# EAGLE schematic DyIO_Rev14 (EAGLE 5.11)

## Sheet 1 of 6
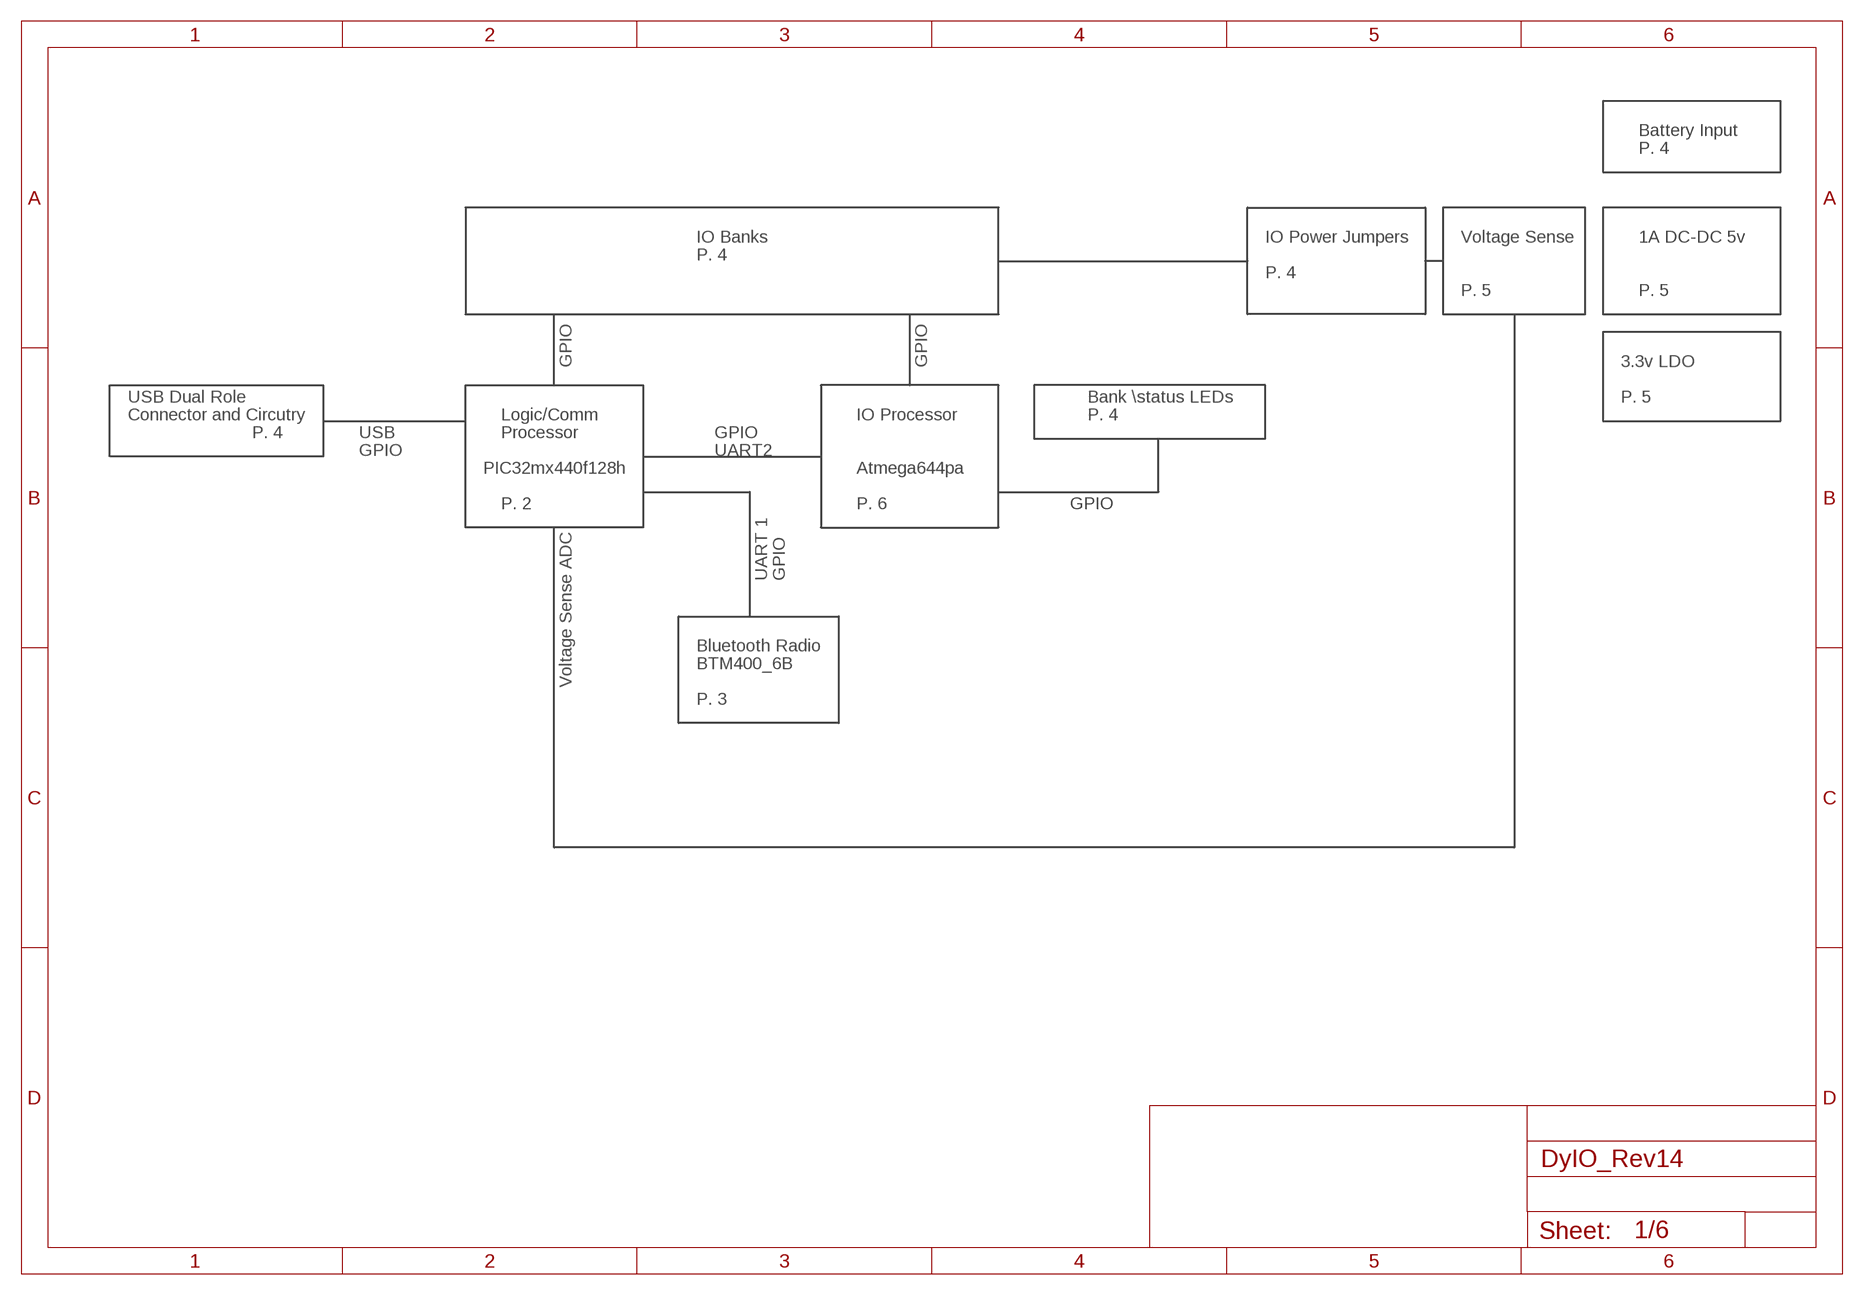
[diagram p0: schematic, sheet 1]

### Notes on the sheet
- Battery Input
- P. 4
- IO Banks | IO Power Jumpers | Voltage Sense | 1A DC-DC 5v
- P. 4
- P. 4
- P. 5 | P. 5
- GPIO | GPIO | 3.3v LDO
- USB Dual Role | Bank \status LEDs | P. 5
- Connector and Circutry | Logic/Comm | IO Processor | P. 4
- P. 4 | USB | Processor | GPIO
- GPIO | UART2
- PIC32mx440f128h | Atmega644pa
- P. 2 | P. 6 | GPIO
- UART 1 | GPIO
- Bluetooth Radio
- BTM400_6B
- Voltage Sense ADC
- P. 3

## Sheet 2 of 6
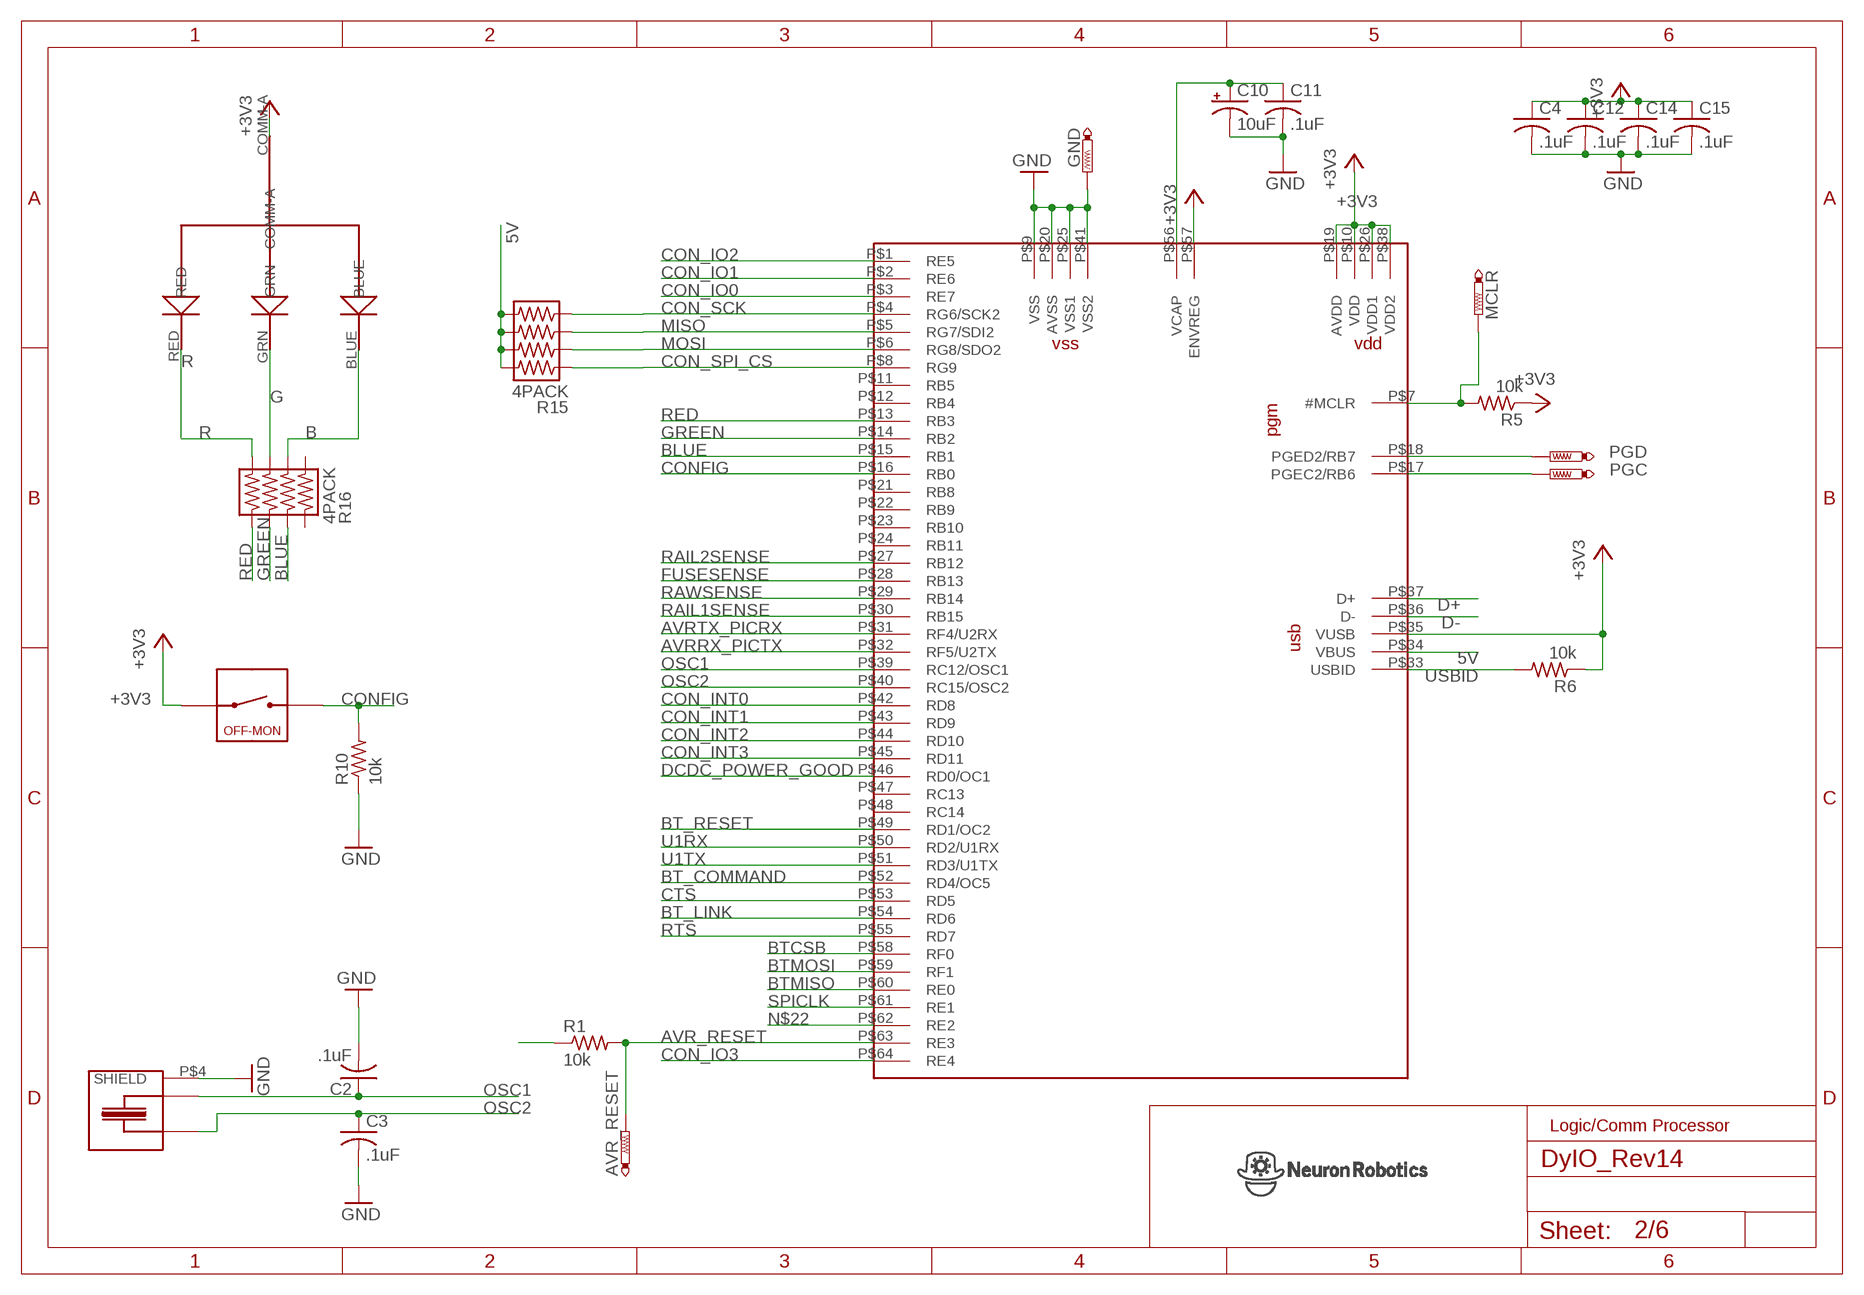
[diagram p1: schematic, sheet 2]

### Parts
AVR_RESET  PTR1TP14R  [TP14R]
C2  .1uF  C-USC0603  [C0603]
C3  .1uF  C-USC0603  [C0603]
C4  .1uF  C-USC0603  [C0603]
C10  10uF  CPOL-USR/2012-12R  [R/2012-12R]
C11  .1uF  C-USC0603  [C0603]
C12  .1uF  C-USC0603  [C0603]
C14  .1uF  C-USC0603  [C0603]
C15  .1uF  C-USC0603  [C0603]
GND  PTR1B1,27  [B1,27]
MCLR  PTR1TP14R  [TP14R]
PGC  PTR1TP14R  [TP14R]
PGD  PTR1TP14R  [TP14R]
R1  10k  R-US_R0603  [R0603]
R5  10k  R-US_R0603  [R0603]
R6  10k  R-US_R0603  [R0603]
R10  10k  R-US_R0603  [R0603]
R15  4PACK  [4PACK_0603]
R16  4PACK  [4PACK_0603]
SW3  SPST  [B3U-1000P]
U3  PIC32-64TQFP64-2  [TQFP64-2]
U8  TRI-LED-SMD  [TRI_LED_SMD]
X2  CMR3XXT  [CMR309T]

### Nets
5V: R1.1 R15.R1A R15.R2A R15.R3A R15.R4A U3.P$34(VBUS) ; also sheet 4,5,6
32MCLR: MCLR.TP R5.2 U3.P$7(#MCLR)
32PGC: PGC.TP U3.P$17(PGEC2/RB6)
32PGD: PGD.TP U3.P$18(PGED2/RB7)
+3V3: C4.1 C12.1 C14.1 C15.1 R5.1 R6.1 SW3.P$1 U3.P$10(VDD) U3.P$19(AVDD) U3.P$26(VDD1) U3.P$35(VUSB) U3.P$38(VDD2) U3.P$57(ENVREG) U8.COMM-A ; also sheet 3,5
AVR_RESET: AVR_RESET.TP R1.2 U3.P$63(RE3) ; also sheet 6
AVRRX_PICTX: U3.P$32(RF5/U2TX) ; also sheet 6
AVRTX_PICRX: U3.P$31(RF4/U2RX) ; also sheet 6
B: R16.R2A U8.BLUE
BLUE: R16.R2B U3.P$15(RB1)
BT_COMMAND: U3.P$52(RD4/OC5) ; also sheet 3
BT_LINK: U3.P$54(RD6) ; also sheet 3
BT_RESET: U3.P$49(RD1/OC2) ; also sheet 3
BTCSB: U3.P$58(RF0) ; also sheet 3
BTMISO: U3.P$60(RE0) ; also sheet 3
BTMOSI: U3.P$59(RF1) ; also sheet 3
CON_INT0: U3.P$42(RD8) ; also sheet 4,6
CON_INT1: U3.P$43(RD9) ; also sheet 4,6
CON_INT2: U3.P$44(RD10) ; also sheet 4,6
CON_INT3: U3.P$45(RD11) ; also sheet 4,6
CON_IO0: U3.P$3(RE7) ; also sheet 4,6
CON_IO1: U3.P$2(RE6) ; also sheet 4,6
CON_IO2: U3.P$1(RE5) ; also sheet 4,6
CON_IO3: U3.P$64(RE4) ; also sheet 4,6
CON_SCK: R15.R4B U3.P$4(RG6/SCK2) ; also sheet 4,6
CON_SPI_CS: R15.R1B U3.P$8(RG9) ; also sheet 4,6
CONFIG: R10.2 SW3.P$3 U3.P$16(RB0)
CTS: U3.P$53(RD5) ; also sheet 6
D+: U3.P$37(D+) ; also sheet 4
D-: U3.P$36(D-) ; also sheet 4
DCDC_POWER_GOOD: U3.P$46(RD0/OC1) ; also sheet 5
FUSESENSE: U3.P$28(RB13) ; also sheet 5
G: R16.R3A U8.GRN
GND: C2.2 C3.2 C4.2 C10.- C11.2 C12.2 C14.2 C15.2 GND.PP(TP) R10.1 U3.P$9(VSS) U3.P$20(AVSS) U3.P$25(VSS1) U3.P$41(VSS2) X2.P$4(SHIELD) ; also sheet 3,4,5,6
GREEN: R16.R3B U3.P$14(RB2)
MISO: R15.R3B U3.P$5(RG7/SDI2) ; also sheet 4,6
MOSI: R15.R2B U3.P$6(RG8/SDO2) ; also sheet 4,6
N$5: C10.+ C11.1 U3.P$56(VCAP)
N$22: U3.P$62(RE2)
OSC1: C2.1 U3.P$39(RC12/OSC1) X2.P$3
OSC2: C3.1 U3.P$40(RC15/OSC2) X2.P$1
R: R16.R4A U8.RED
RAIL1SENSE: U3.P$30(RB15) ; also sheet 5
RAIL2SENSE: U3.P$27(RB12) ; also sheet 5
RAWSENSE: U3.P$29(RB14) ; also sheet 5
RED: R16.R4B U3.P$13(RB3)
RTS: U3.P$55(RD7) ; also sheet 6
SPICLK: U3.P$61(RE1) ; also sheet 3
U1RX: U3.P$50(RD2/U1RX) ; also sheet 3
U1TX: U3.P$51(RD3/U1TX) ; also sheet 3
USBID: R6.2 U3.P$33(USBID) ; also sheet 4
Unconnected: R16.R1A R16.R1B U3.P$11(RB5) U3.P$12(RB4) U3.P$21(RB8) U3.P$22(RB9) U3.P$23(RB10) U3.P$24(RB11) U3.P$47(RC13) U3.P$48(RC14)

### Notes on the sheet
- Logic/Comm Processor

## Sheet 3 of 6
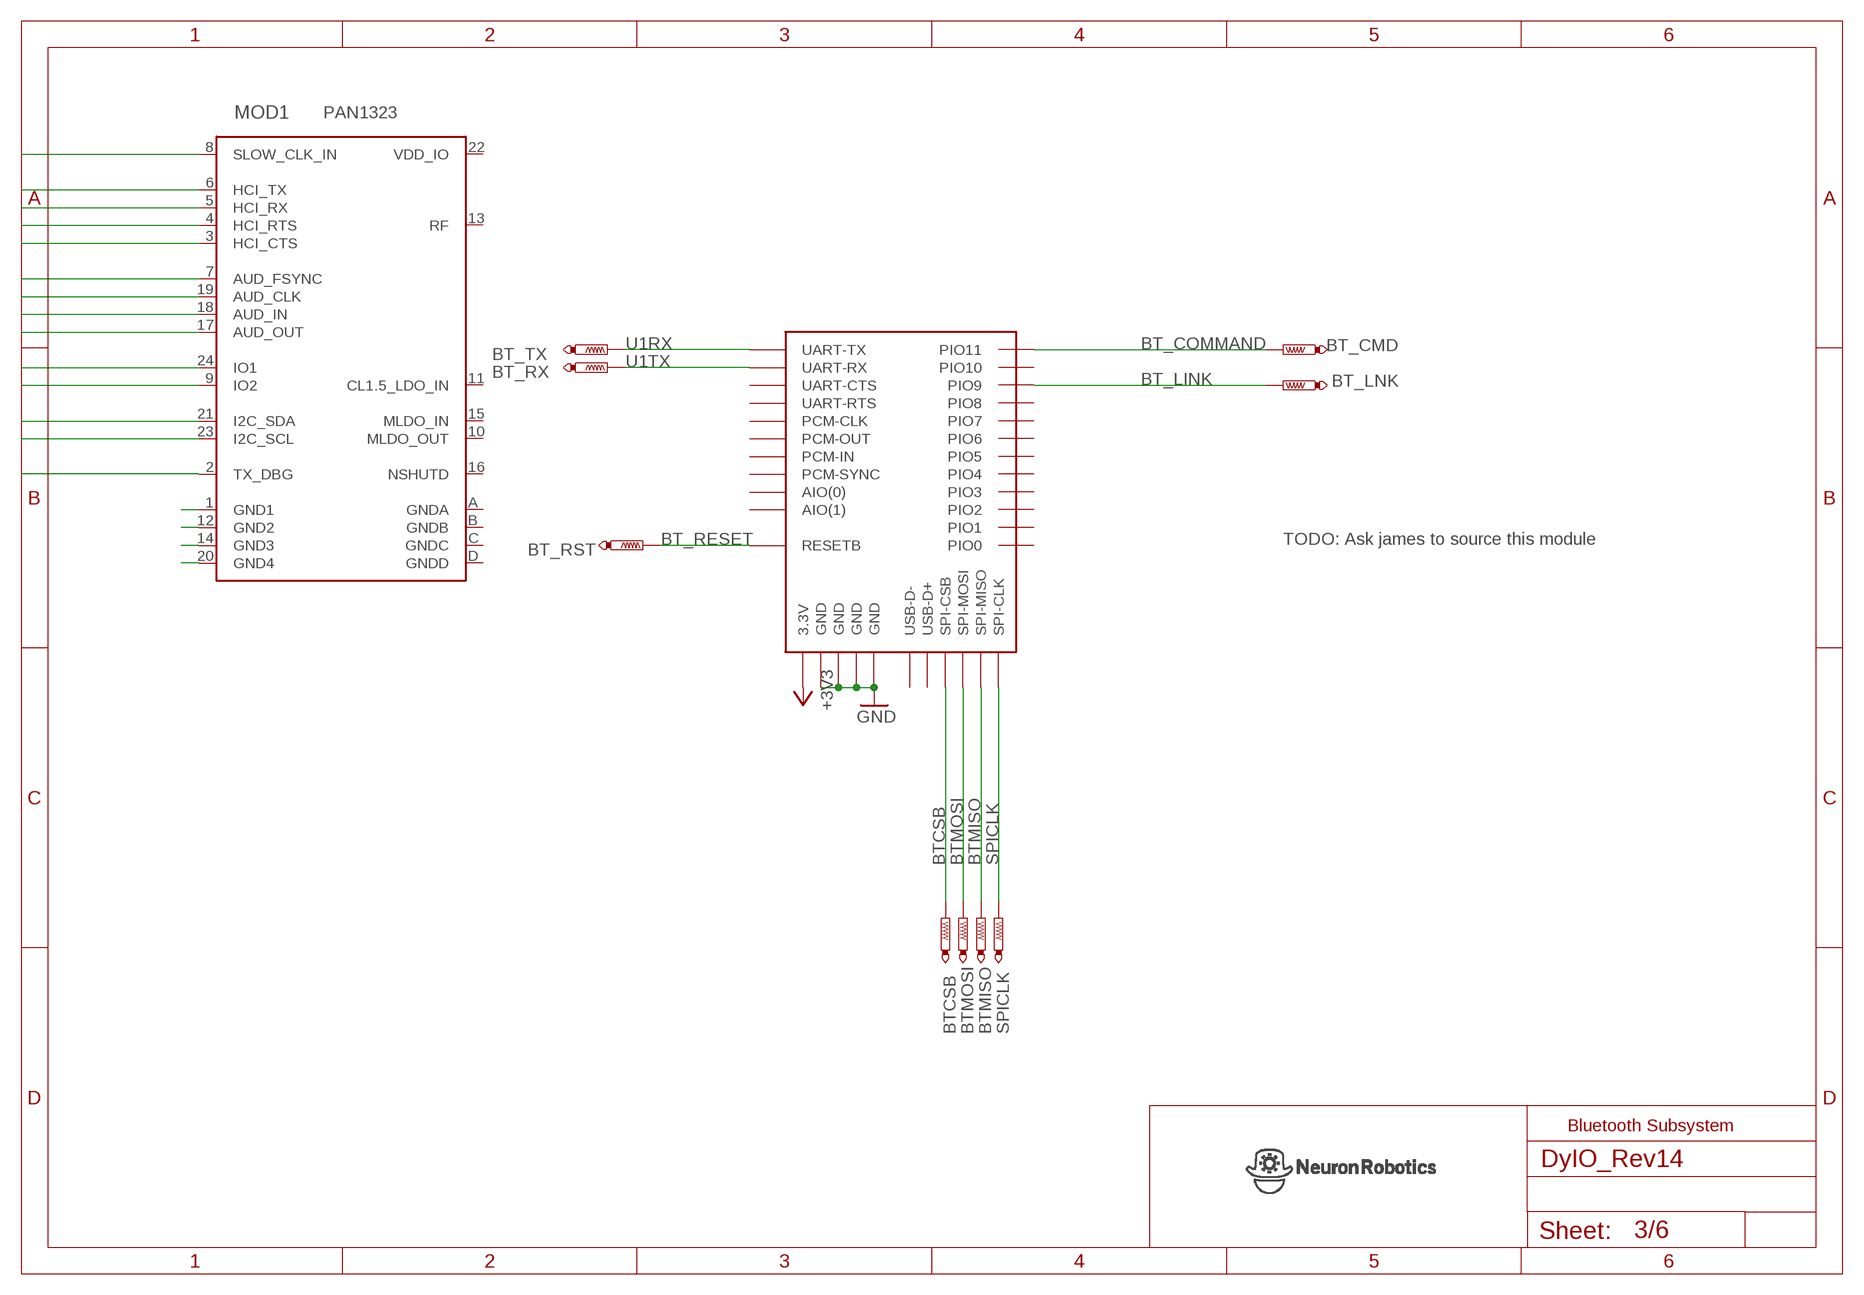
[diagram p2: schematic, sheet 3]

### Parts
BT_CMD  PTR1TP14R  [TP14R]
BT_LNK  PTR1TP14R  [TP14R]
BT_RST  PTR1TP14R  [TP14R]
BT_RX  PTR1TP14R  [TP14R]
BT_TX  PTR1TP14R  [TP14R]
BTCSB  PTR1TP14R  [TP14R]
BTMISO  PTR1TP14R  [TP14R]
BTMOSI  PTR1TP14R  [TP14R]
MOD1  PAN1323  PAN1315  [P1325FP]
SPICLK  PTR1TP14R  [TP14R]
U$1  BTM400_6B  [BTM400_6B]

### Nets
+3V3: U$1.3.3V ; also sheet 2,5
AUD_CLK_1V8: MOD1.19(AUD_CLK)
AUD_FSYNC_1V8: MOD1.7(AUD_FSYNC)
AUD_IN_1V8: MOD1.18(AUD_IN)
AUD_OUT_1V8: MOD1.17(AUD_OUT)
BT_COMMAND: BT_CMD.TP U$1.PIO(11)(PIO11) ; also sheet 2
BT_LINK: BT_LNK.TP U$1.PIO(9)(PIO9) ; also sheet 2
BT_RESET: BT_RST.TP U$1.RESETB ; also sheet 2
BTCSB: BTCSB.TP U$1.SPI-CSB ; also sheet 2
BTMISO: BTMISO.TP U$1.SPI-MISO ; also sheet 2
BTMOSI: BTMOSI.TP U$1.SPI-MOSI ; also sheet 2
GND: MOD1.1(GND1) MOD1.12(GND2) MOD1.14(GND3) MOD1.20(GND4) U$1.GND@1(GND) U$1.GND@2(GND) U$1.GND@3(GND) U$1.GND@4(GND) ; also sheet 2,4,5,6
HCI_CTS_1V8: MOD1.3(HCI_CTS)
HCI_RTS_1V8: MOD1.4(HCI_RTS)
HCI_RX_1V8: MOD1.5(HCI_RX)
HCI_TX_1V8: MOD1.6(HCI_TX)
I2C_SCL_1V8: MOD1.23(I2C_SCL)
I2C_SDA_1V8: MOD1.21(I2C_SDA)
IO1_1V8: MOD1.24(IO1)
IO2_1V8: MOD1.9(IO2)
SLOW_CLK_IN_1V8: MOD1.8(SLOW_CLK_IN)
SPICLK: SPICLK.TP U$1.SPI-CLK ; also sheet 2
TX_DBG_1V8: MOD1.2(TX_DBG)
U1RX: BT_TX.TP U$1.UART-TX ; also sheet 2
U1TX: BT_RX.TP U$1.UART-RX ; also sheet 2
Unconnected: MOD1.10(MLDO_OUT) MOD1.11(CL1.5_LDO_IN) MOD1.13(RF) MOD1.15(MLDO_IN) MOD1.16(NSHUTD) MOD1.22(VDD_IO) MOD1.A(GNDA) MOD1.B(GNDB) MOD1.C(GNDC) MOD1.D(GNDD) U$1.AIO(0) U$1.AIO(1) U$1.PCM-CLK U$1.PCM-IN U$1.PCM-OUT U$1.PCM-SYNC U$1.PIO(0)(PIO0) U$1.PIO(1)(PIO1) U$1.PIO(2)(PIO2) U$1.PIO(3)(PIO3) U$1.PIO(4)(PIO4) U$1.PIO(5)(PIO5) U$1.PIO(6)(PIO6) U$1.PIO(7)(PIO7) U$1.PIO(8)(PIO8) U$1.PIO(10)(PIO10) U$1.UART-CTS U$1.UART-RTS U$1.USB-D+ U$1.USB-D-

### Notes on the sheet
- PAN1323
- TODO: Ask james to source this module
- Bluetooth Subsystem

## Sheet 4 of 6
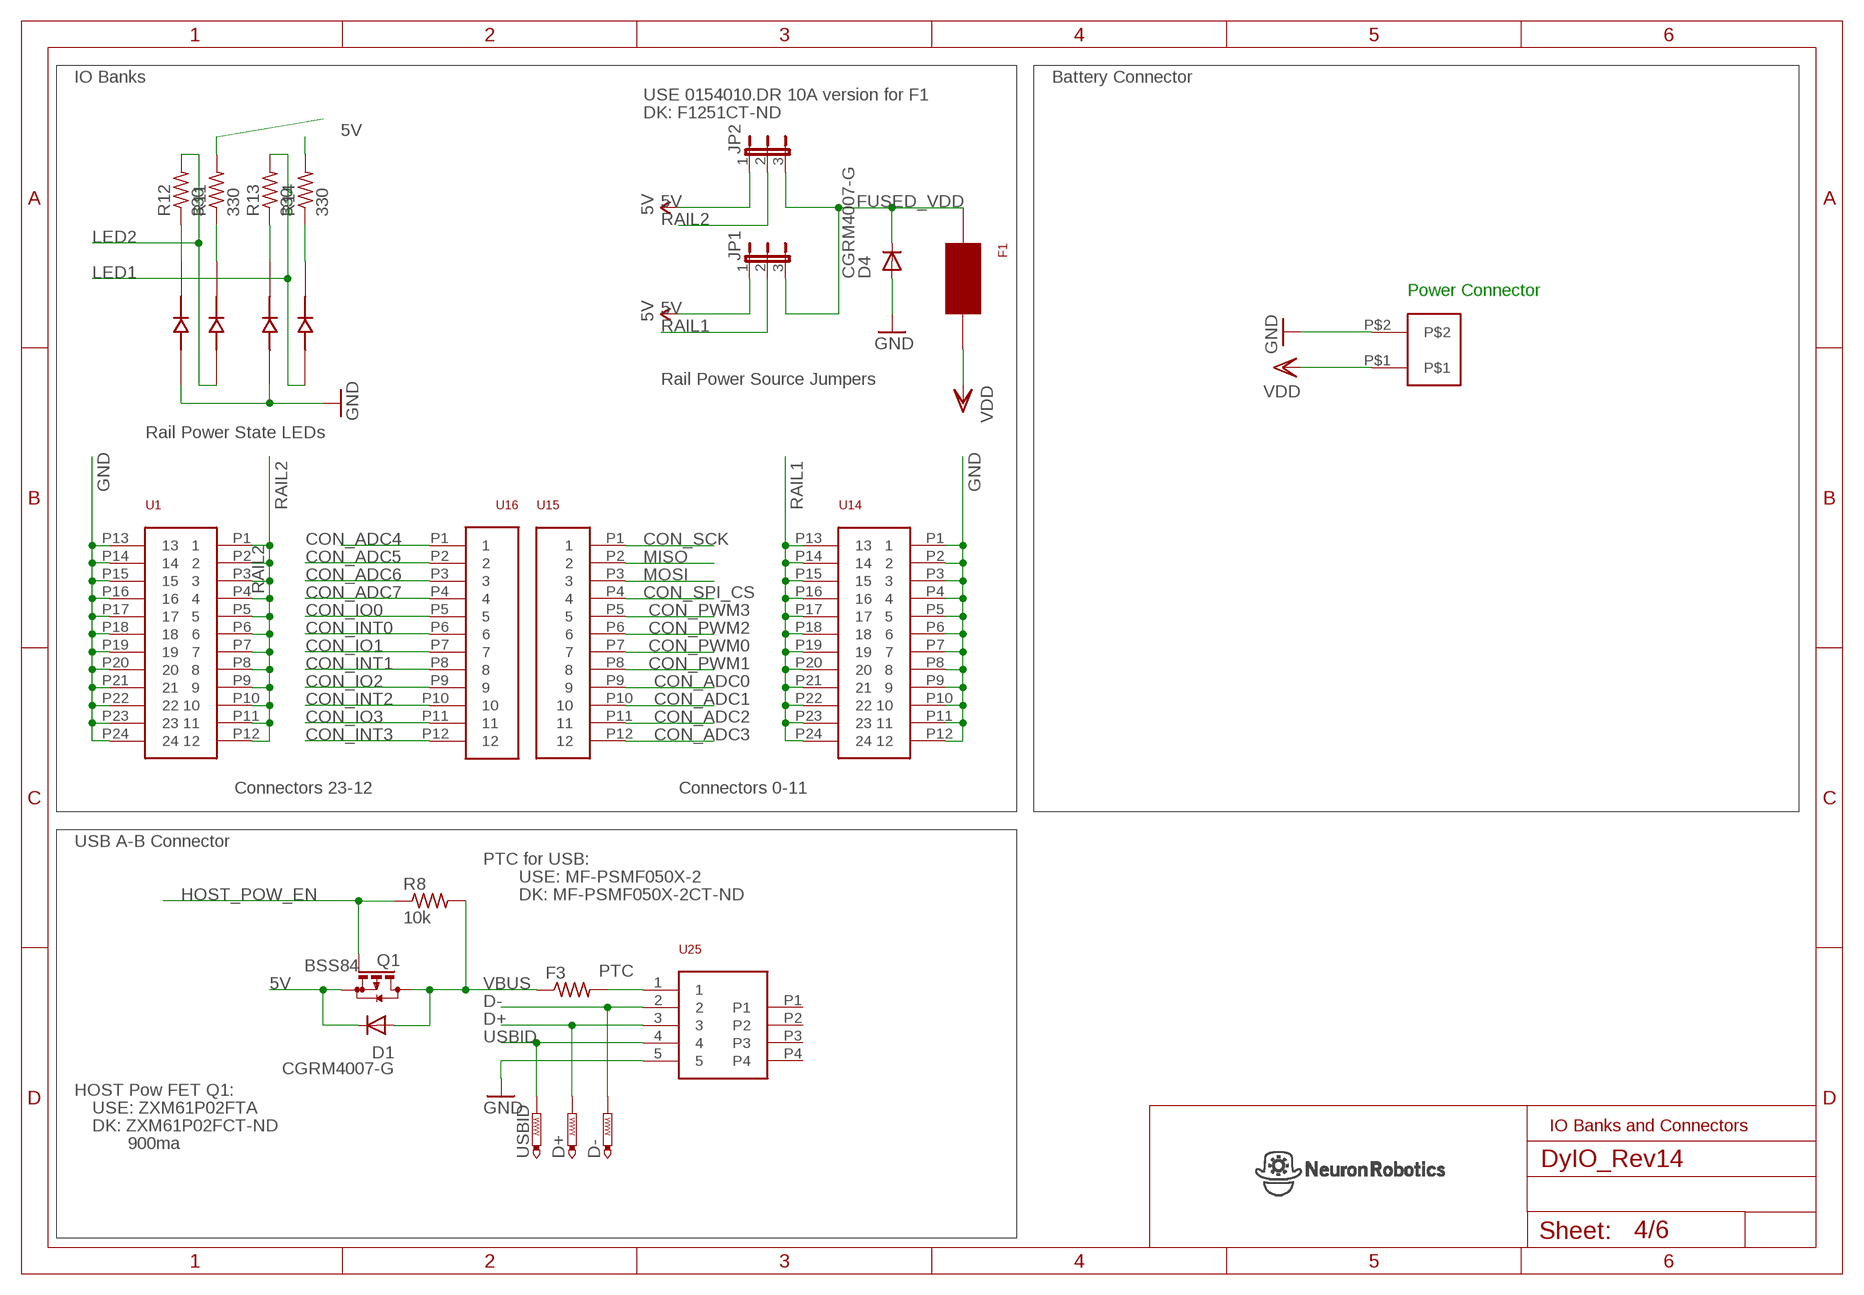
[diagram p3: schematic, sheet 4]

### Parts
D1  CGRM4007-G  [SOD-123_MINI-SMA]
D4  CGRM4007-G  [SOD-123_MINI-SMA]
D+  PTR1TP14R  [TP14R]
D-  PTR1TP14R  [TP14R]
F1  0154  [0154]
F3  PTC  R-US_R2012  [R2012]
JP1  JP2E  [JP2]
JP2  JP2E  [JP2]
Q1  BSS84  [SOT23]
R8  10k  R-US_R0603  [R0603]
R11  330  R-US_R0603  [R0603]
R12  330  R-US_R0603  [R0603]
R13  330  R-US_R0603  [R0603]
R14  330  R-US_R0603  [R0603]
U1  2X12  [2X12]
U7  2CLED  [1.6X1.5]
U13  2CLED  [1.6X1.5]
U14  2X12  [2X12]
U15  1X12  [1X12]
U16  1X12  [1X12]
U25  1734035-1_USB  [1734035-1_1734035]
U$19  2P  [2PTH]
USBID  PTR1TP14R  [TP14R]

### Nets
5V: D1.C JP1.1 JP2.1 Q1.2(S) R11.2 R14.2 ; also sheet 2,5,6
CON_ADC0: U15.P9 ; also sheet 6
CON_ADC1: U15.P10 ; also sheet 6
CON_ADC2: U15.P11 ; also sheet 6
CON_ADC3: U15.P12 ; also sheet 6
CON_ADC4: U16.P1 ; also sheet 6
CON_ADC5: U16.P2 ; also sheet 6
CON_ADC6: U16.P3 ; also sheet 6
CON_ADC7: U16.P4 ; also sheet 6
CON_INT0: U16.P6 ; also sheet 2,6
CON_INT1: U16.P8 ; also sheet 2,6
CON_INT2: U16.P10 ; also sheet 2,6
CON_INT3: U16.P12 ; also sheet 2,6
CON_IO0: U16.P5 ; also sheet 2,6
CON_IO1: U16.P7 ; also sheet 2,6
CON_IO2: U16.P9 ; also sheet 2,6
CON_IO3: U16.P11 ; also sheet 2,6
CON_PWM0: U15.P7 ; also sheet 6
CON_PWM1: U15.P8 ; also sheet 6
CON_PWM2: U15.P6 ; also sheet 6
CON_PWM3: U15.P5 ; also sheet 6
CON_SCK: U15.P1 ; also sheet 2,6
CON_SPI_CS: U15.P4 ; also sheet 2,6
D+: D+.TP U25.3 ; also sheet 2
D-: D-.TP U25.2 ; also sheet 2
FUSED_VDD: D4.C F1.1 JP1.3 JP2.3 ; also sheet 5
GND: D4.A U1.P13 U1.P14 U1.P15 U1.P16 U1.P17 U1.P18 U1.P19 U1.P20 U1.P21 U1.P22 U1.P23 U1.P24 U7.1T U13.1T U14.P1 U14.P2 U14.P3 U14.P4 U14.P5 U14.P6 U14.P7 U14.P8 U14.P9 U14.P10 U14.P11 U14.P12 U25.5 U$19.P$2 ; also sheet 2,3,5,6
HOST_POW_EN: Q1.1(G) R8.1
LED1: R13.2 U13.2T ; also sheet 6
LED2: R12.2 U7.2T ; also sheet 6
MISO: U15.P2 ; also sheet 2,6
MOSI: U15.P3 ; also sheet 2,6
N$10: F3.2 U25.1
N$14: R12.1 U7.1A
N$25: R13.1 U13.1A
N$26: R11.1 U7.2A
N$30: R14.1 U13.2A
RAIL1: JP1.2 U14.P13 U14.P14 U14.P15 U14.P16 U14.P17 U14.P18 U14.P19 U14.P20 U14.P21 U14.P22 U14.P23 U14.P24 ; also sheet 5
RAIL2: JP2.2 U1.P1 U1.P2 U1.P3 U1.P4 U1.P5 U1.P6 U1.P7 U1.P8 U1.P9 U1.P10 U1.P11 U1.P12 ; also sheet 5
USBID: U25.4 USBID.TP ; also sheet 2
VBUS: D1.A F3.1 Q1.3(D) R8.2
VDD: F1.2 U$19.P$1 ; also sheet 5
Unconnected: U25.P1 U25.P2 U25.P3 U25.P4

### Notes on the sheet
- IO Banks | Battery Connector
- USE 0154010.DR 10A version for F1
- DK: F1251CT-ND
- Power Connector
- Rail Power Source Jumpers
- Rail Power State LEDs
- Connectors 23-12 | Connectors 0-11
- USB A-B Connector
- PTC for USB:
- USE: MF-PSMF050X-2
- DK: MF-PSMF050X-2CT-ND
- HOST Pow FET Q1:
- USE: ZXM61P02FTA
- DK: ZXM61P02FCT-ND | IO Banks and Connectors
- 900ma

## Sheet 5 of 6
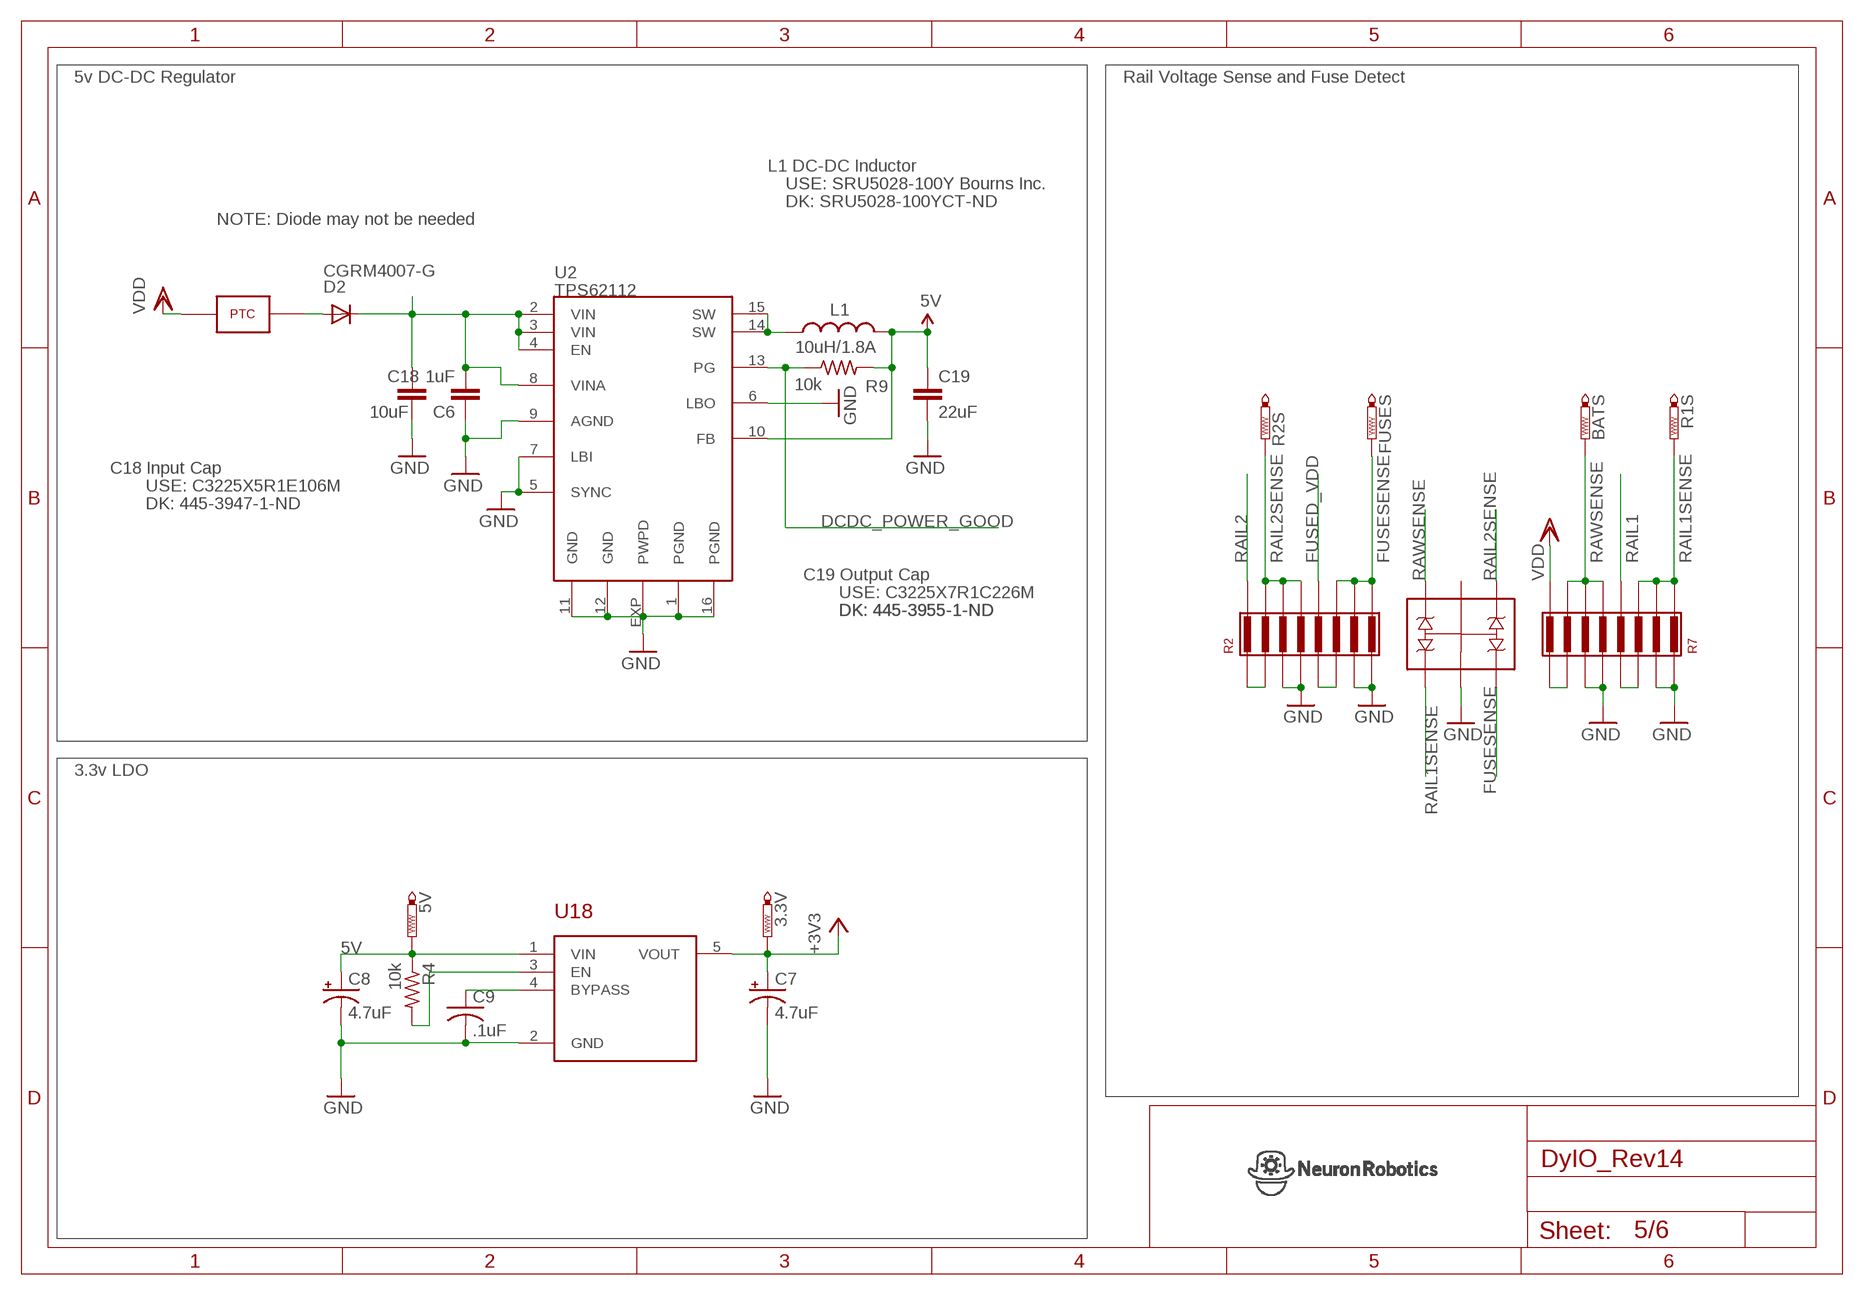
[diagram p4: schematic, sheet 5]

### Parts
3.3V  PTR1TP14R  [TP14R]
5V  PTR1TP14R  [TP14R]
BATS  PTR1TP14R  [TP14R]
C6  1uF  CAP0603-CAP  [0603-CAP]
C7  4.7uF  CPOL-USR/2012-12R  [R/2012-12R]
C8  4.7uF  CPOL-USR/2012-12R  [R/2012-12R]
C9  .1uF  C-USC0402  [C0402]
C18  10uF  CAP1210  [1210]
C19  22uF  CAP1210  [1210]
D2  CGRM4007-G  [SOD-123_MINI-SMA]
F2  F1812  [F1812]
FUSES  PTR1TP14R  [TP14R]
L1  10uH/1.8A  INDUCTORSRU5028  [SRU5028]
R1S  PTR1TP14R  [TP14R]
R2  741X163  [741X163]
R2S  PTR1TP14R  [TP14R]
R4  10k  R-US_R0402  [R0402]
R7  741X163  [741X163]
R9  10k  R-US_R0603  [R0603]
U2  TPS62112  TPS6211  [QFN16-4X4]
U18  LDS3985XX33  [SOT23-5]
U$20  UCLAMP3304A  [UCLAMP3304A]

### Nets
5V: 5V.TP C8.+ C19.1 L1.2 R4.1 R9.2 U2.10(FB) U18.1(VIN) ; also sheet 2,4,6
+3V3: 3.3V.TP C7.+ U18.5(VOUT) ; also sheet 2,3
DCDC_POWER_GOOD: R9.1 U2.13(PG) ; also sheet 2
FUSED_VDD: R2.R5B ; also sheet 4
FUSESENSE: FUSES.TP R2.R6B R2.R7B R2.R8B U$20.3 ; also sheet 2
GND: C6.1 C7.- C8.- C9.2 C18.2 C19.2 R2.R3A R2.R4A R2.R7A R2.R8A R7.R1A R7.R2A R7.R5A R7.R6A U2.1(PGND) U2.5(SYNC) U2.6(LBO) U2.7(LBI) U2.9(AGND) U2.11(GND) U2.12(GND) U2.16(PGND) U2.EXP(PWPD) U18.2(GND) U$20.2 ; also sheet 2,3,4,6
N$2: R4.2 U18.3(EN)
N$3: C9.1 U18.4(BYPASS)
N$4: D2.A F2.P$2
N$12: R7.R7A R7.R8A
N$20: C6.2 C18.1 D2.C U2.2(VIN) U2.3(VIN) U2.4(EN) U2.8(VINA)
N$33: R2.R5A R2.R6A
N$35: R7.R3A R7.R4A
N$36: R2.R1A R2.R2A
RAIL1: R7.R4B ; also sheet 4
RAIL1SENSE: R1S.TP R7.R1B R7.R2B R7.R3B U$20.1 ; also sheet 2
RAIL2: R2.R1B ; also sheet 4
RAIL2SENSE: R2.R2B R2.R3B R2.R4B R2S.TP U$20.4 ; also sheet 2
RAWSENSE: BATS.TP R7.R5B R7.R6B R7.R7B U$20.6 ; also sheet 2
SW: L1.1 U2.14(SW) U2.15(SW)
VDD: F2.P$1 R7.R8B ; also sheet 4
Unconnected: U$20.5

### Notes on the sheet
- 5v DC-DC Regulator | Rail Voltage Sense and Fuse Detect
- L1 DC-DC Inductor
- USE: SRU5028-100Y Bourns Inc.
- DK: SRU5028-100YCT-ND
- NOTE: Diode may not be needed
- C18 Input Cap
- USE: C3225X5R1E106M
- DK: 445-3947-1-ND
- C19 Output Cap
- USE: C3225X7R1C226M
- DK: 445-3955-1-ND | DK: 445-3955-1-ND
- 3.3v LDO

## Sheet 6 of 6
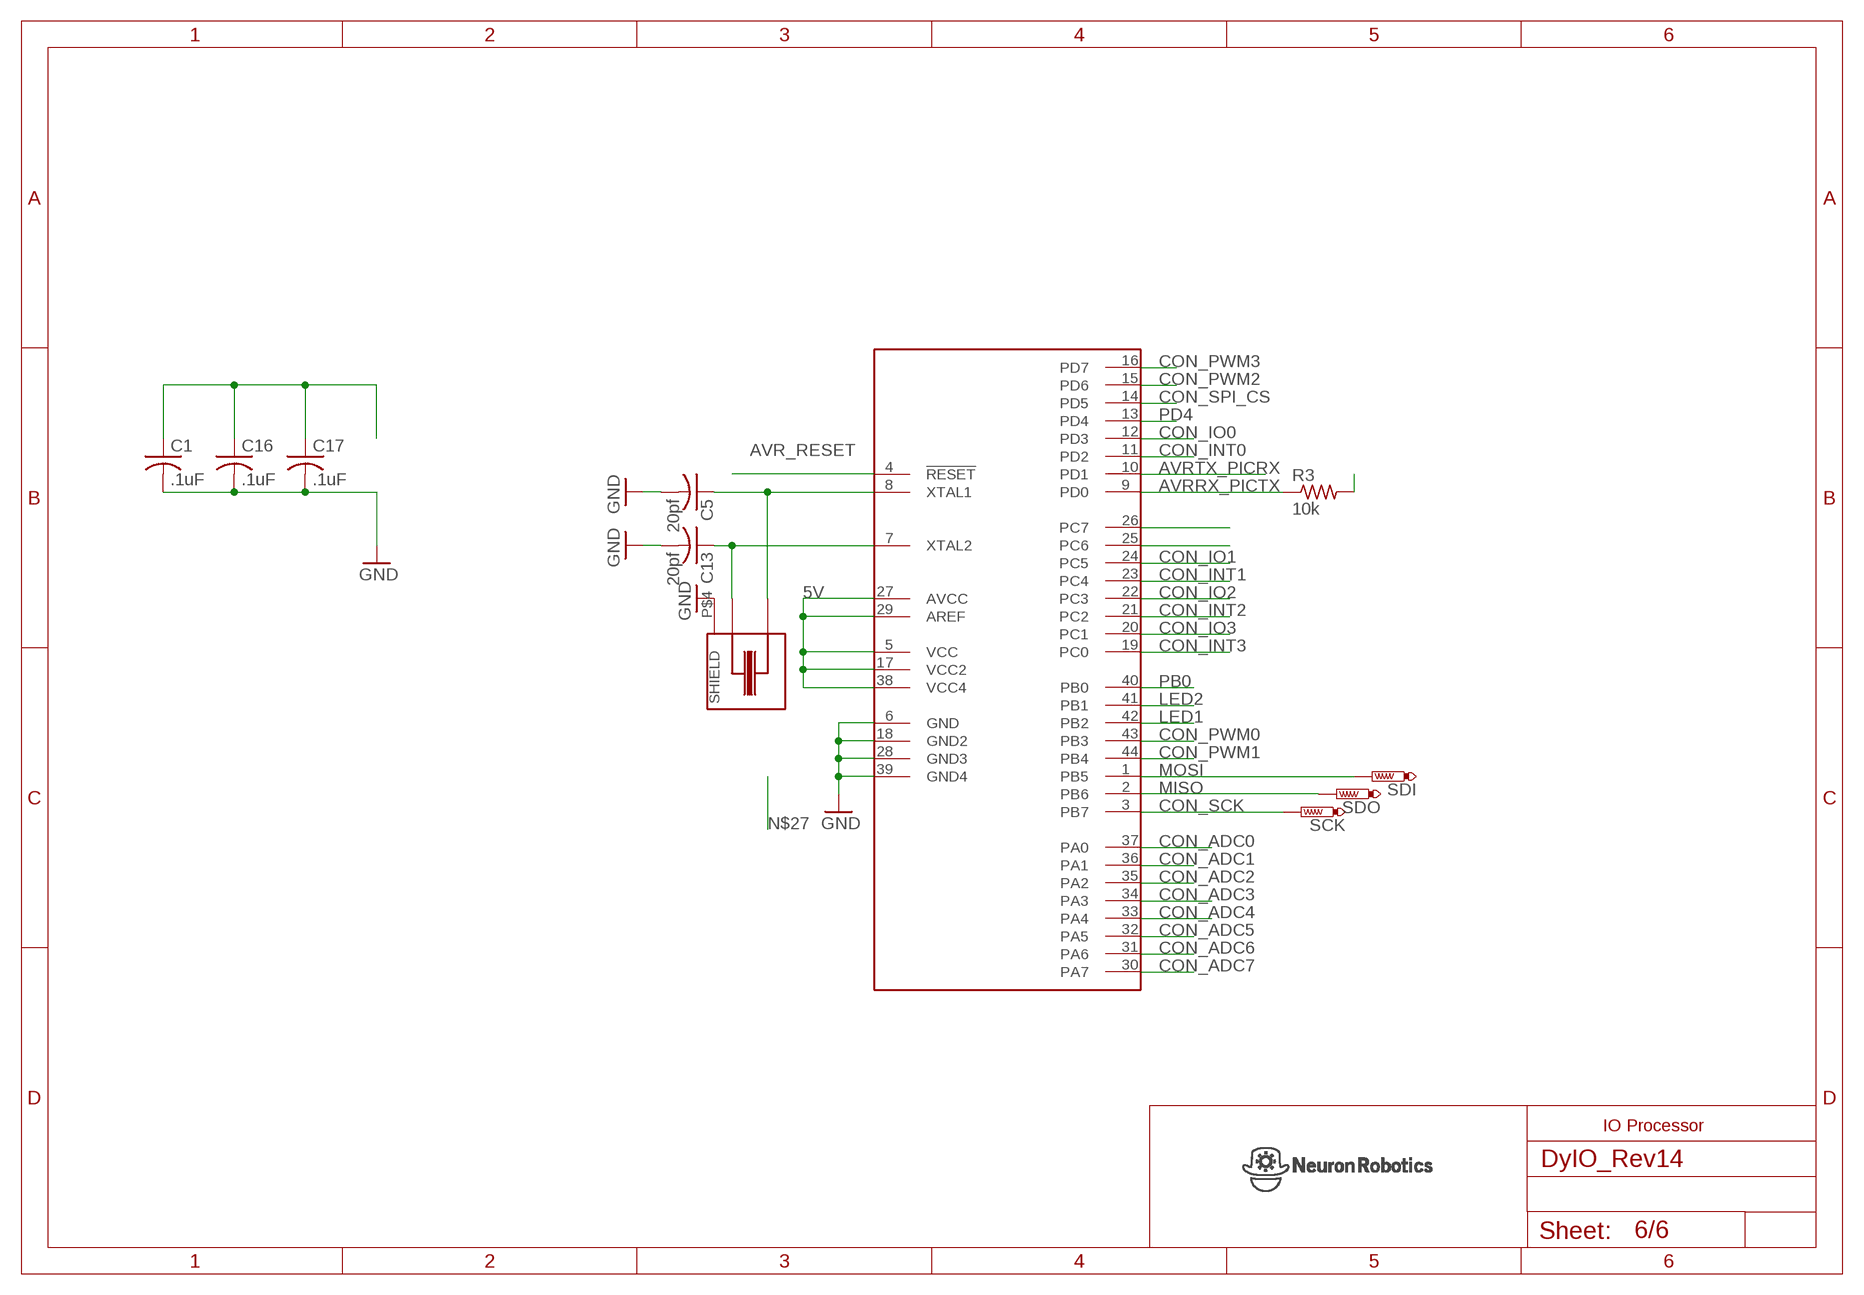
[diagram p5: schematic, sheet 6]

### Parts
C1  .1uF  C-USC0603  [C0603]
C5  20pf  C-USC0603  [C0603]
C13  20pf  C-USC0603  [C0603]
C16  .1uF  C-USC0603  [C0603]
C17  .1uF  C-USC0603  [C0603]
R3  10k  R-US_R0603  [R0603]
SCK  PTR1TP14R  [TP14R]
SDI  PTR1TP14R  [TP14R]
SDO  PTR1TP14R  [TP14R]
U$2  ATMEGA644QFP  [TQFP44]
X4  CMR3XXT  [CMR309T]

### Nets
5V: C1.1 C16.1 C17.1 R3.2 U$2.5(VCC) U$2.17(VCC2) U$2.27(AVCC) U$2.29(AREF) U$2.38(VCC4) ; also sheet 2,4,5
AVR_RESET: U$2.4(!RESET) ; also sheet 2
AVRRX_PICTX: R3.1 U$2.9(PD0) ; also sheet 2
AVRTX_PICRX: U$2.10(PD1) ; also sheet 2
CON_ADC0: U$2.37(PA0) ; also sheet 4
CON_ADC1: U$2.36(PA1) ; also sheet 4
CON_ADC2: U$2.35(PA2) ; also sheet 4
CON_ADC3: U$2.34(PA3) ; also sheet 4
CON_ADC4: U$2.33(PA4) ; also sheet 4
CON_ADC5: U$2.32(PA5) ; also sheet 4
CON_ADC6: U$2.31(PA6) ; also sheet 4
CON_ADC7: U$2.30(PA7) ; also sheet 4
CON_INT0: U$2.11(PD2) ; also sheet 2,4
CON_INT1: U$2.23(PC4) ; also sheet 2,4
CON_INT2: U$2.21(PC2) ; also sheet 2,4
CON_INT3: U$2.19(PC0) ; also sheet 2,4
CON_IO0: U$2.12(PD3) ; also sheet 2,4
CON_IO1: U$2.24(PC5) ; also sheet 2,4
CON_IO2: U$2.22(PC3) ; also sheet 2,4
CON_IO3: U$2.20(PC1) ; also sheet 2,4
CON_PWM0: U$2.43(PB3) ; also sheet 4
CON_PWM1: U$2.44(PB4) ; also sheet 4
CON_PWM2: U$2.15(PD6) ; also sheet 4
CON_PWM3: U$2.16(PD7) ; also sheet 4
CON_SCK: SCK.TP U$2.3(PB7) ; also sheet 2,4
CON_SPI_CS: U$2.14(PD5) ; also sheet 2,4
CTS: U$2.26(PC7) ; also sheet 2
GND: C1.2 C5.2 C13.2 C16.2 C17.2 U$2.6(GND) U$2.18(GND2) U$2.28(GND3) U$2.39(GND4) X4.P$4(SHIELD) ; also sheet 2,3,4,5
LED1: U$2.42(PB2) ; also sheet 4
LED2: U$2.41(PB1) ; also sheet 4
MISO: SDO.TP U$2.2(PB6) ; also sheet 2,4
MOSI: SDI.TP U$2.1(PB5) ; also sheet 2,4
N$8: C5.1 U$2.8(XTAL1) X4.P$1
N$9: C13.1 U$2.7(XTAL2) X4.P$3
PB0: U$2.40(PB0)
PD4: U$2.13(PD4)
RTS: U$2.25(PC6) ; also sheet 2

### Notes on the sheet
- IO Processor

## Library data of the parts
3.3V 5V AVR_RESET BATS BT_CMD BT_LNK BT_RST BT_RX BT_TX BTCSB BTMISO BTMOSI D+ D- FUSES GND MCLR PGC PGD R1S R2S SCK SDI SDO SPICLK USBID = testpad:PTR1: TEST PIN
C1-C5 C9 C11-C17 = rcl:C-US: CAPACITOR, American symbol
C6 C18 C19 = SparkFun:CAP: Capacitor Standard 0603 ceramic capacitor, and 0.1" leaded capacitor.
C7 C8 C10 = rcl:CPOL-US: POLARIZED CAPACITOR, American symbol
D1 D2 D4 = diode:CGRM400*-G: Molded plasitc,JEDEC SOD-123/Mini SMA Source: Comchip CGRM4001-G.pdf
F1 = SMT_Fuse_0154001:0154
F2 = 1812lfuse:F1812
F3 R1 R3-R6 R8-R14 = rcl:R-US_: RESISTOR, American symbol
JP1 JP2 = jumper:JP2E: JUMPER
L1 = SparkFun:INDUCTOR: Inductors Basic Inductor/Choke - 0603 and 1206. Footprints are not proven and vary greatly between part numbers.
MOD1 = P1325:PAN1315
Q1 = transistor-small-signal:BSS84: P-CHANNEL MOS FET
R2 R7 = 741X163:741X163
R15 R16 = ResistorBlocks:4PACK: This is a 0603x4 resistor block. Digikey PN:MNR14103RCT-ND
SW3 = B3U-1000P:SPST
U1 U14 = 1x12_header:2X12
U2 = SparkFun:TPS6211*: TPS62112: 1.5A Step-Down Converter
U3 = pic32:PIC32-64
U7 U13 = 2cled:2CLED: 160-1452-1-ND
U8 = TRI_LED_SMD:TRI-LED-SMD: Common Annode smd tri-color RGB led.
U15 U16 = 1x12_header:1X12
U18 = LDS3985XX33:LDS3985XX33
U25 = YESIN_USB:1734035-1_USB
U$1 = misc:BTM400_6B
U$2 = atmega644:ATMEGA644
U$19 = con_2h_70555-0001:2P
U$20 = UCLAMP3304A:UCLAMP3304A
X2 X4 = cmr3XXT:CMR3XXT